# EAGLE schematic final header (EAGLE 9.6.1)
PAVA PRO TOP ADD & BLOCK
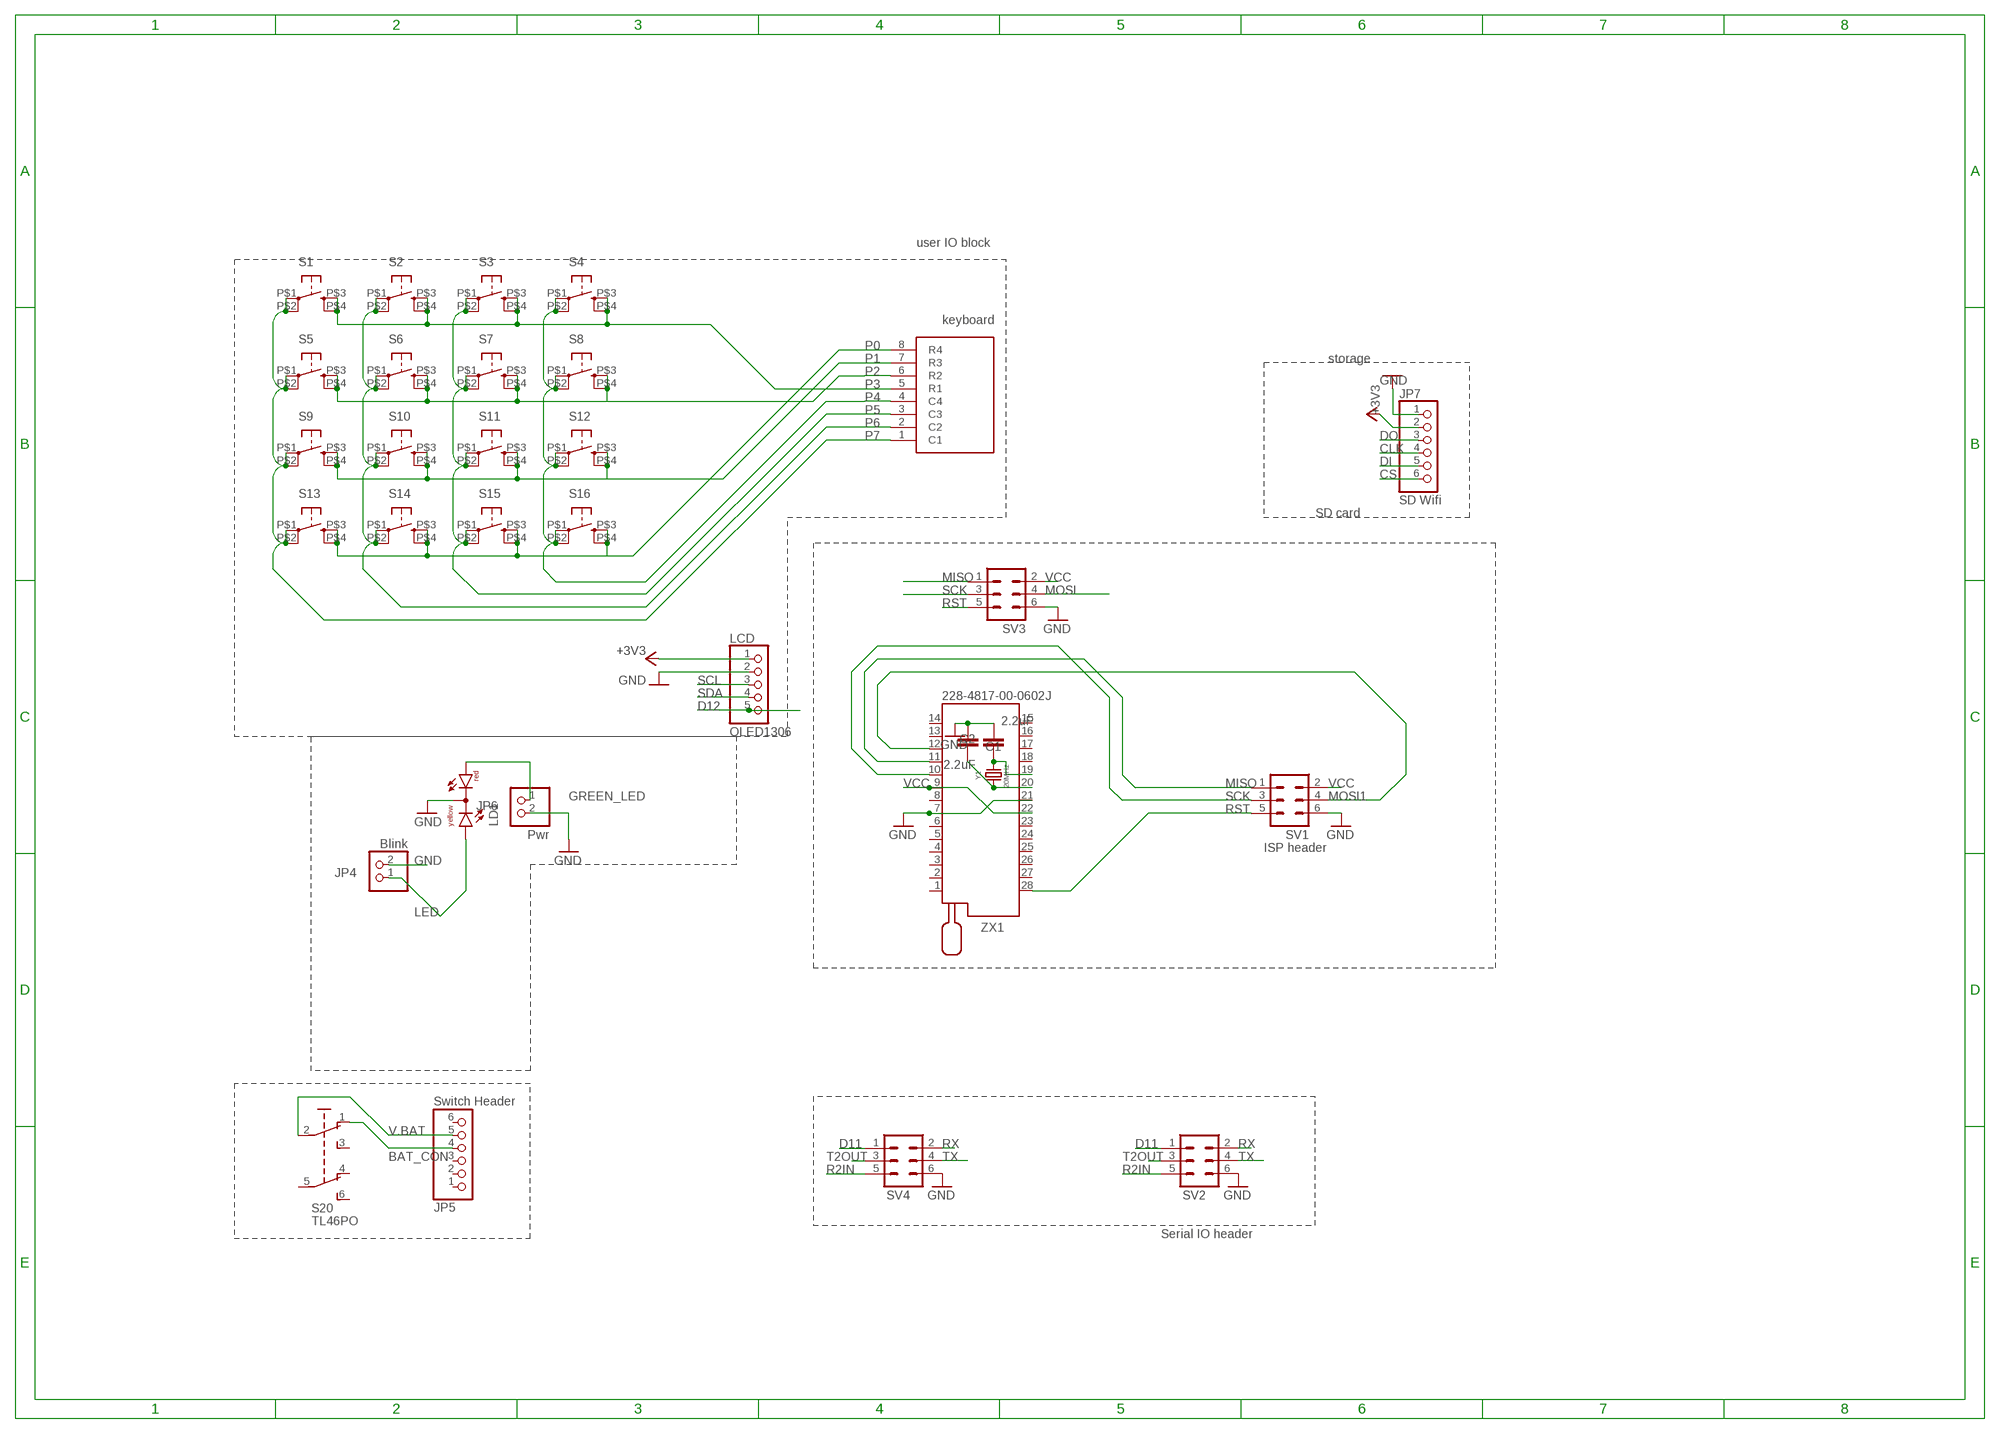
[diagram p0: schematic, sheet 1]

## Parts
C1  2.2uF  2.2UF-1206-50V-10%  [1206]
C2  2.2uF  2.2UF-1206-50V-10%  [1206]
JP4  Blink  PINHD-1X2  [1X02]
JP5  Switch Header  PINHD-1X6  [1X06]
JP6  Pwr  PINHD-1X2  [1X02]
JP7  SD Wifi  PINHD-1X6  [1X06]
LCD  OLED1306  PINHD-1X5  [1X05]
LD1  DUOLED-RY-C  [DUOLED-C-5MM]
S1  10-XX-SMD  [B3F-10XX-SMD]
S2  10-XX-SMD  [B3F-10XX-SMD]
S3  10-XX-SMD  [B3F-10XX-SMD]
S4  10-XX-SMD  [B3F-10XX-SMD]
S5  10-XX-SMD  [B3F-10XX-SMD]
S6  10-XX-SMD  [B3F-10XX-SMD]
S7  10-XX-SMD  [B3F-10XX-SMD]
S8  10-XX-SMD  [B3F-10XX-SMD]
S9  10-XX-SMD  [B3F-10XX-SMD]
S10  10-XX-SMD  [B3F-10XX-SMD]
S11  10-XX-SMD  [B3F-10XX-SMD]
S12  10-XX-SMD  [B3F-10XX-SMD]
S13  10-XX-SMD  [B3F-10XX-SMD]
S14  10-XX-SMD  [B3F-10XX-SMD]
S15  10-XX-SMD  [B3F-10XX-SMD]
S16  10-XX-SMD  [B3F-10XX-SMD]
S20  TL46PO  [TL4XPO]
SV1  ML6  [ML6]
SV2  ML6  [ML6]
SV3  ML6  [ML6]
SV4  ML6  [ML6]
U$7  KB1604  [KB1604]
Y1  20MHz  WE-XTAL_HC49/4HSMX_830061856  [WE-XTAL_HC49/4HSMX]
ZX1  228-4817-00-0602J  [228-4817-00-0602J]

## Nets
+3V3: JP7.2 LCD.1
BAT_CON: JP5.4 S20.1(O)
CLK: JP7.4
CS: JP7.6
D11: SV2.1 SV4.1
D12: LCD.5
DI: JP7.5
DO: JP7.3
GND: C1.2 C2.1 JP4.2 JP6.2 JP7.1 LCD.2 LD1.C SV1.6 SV2.6 SV3.6 SV4.6 ZX1.7 ZX1.21
GREEN_LED: JP6.1 LD1.AR
LED: JP4.1 LD1.AX(AY)
MISO: SV1.1 SV3.1 ZX1.11
MOSI: SV3.4
MOSI1: SV1.4 ZX1.12
N$2: C2.2 Y1.1 ZX1.20
N$3: C1.1 Y1.2 ZX1.19
N$35: S9.P$3(S) S9.P$4(S1) S10.P$3(S) S10.P$4(S1) S11.P$3(S) S11.P$4(S1) S12.P$3(S) S12.P$4(S1)
P0: S13.P$3(S) S13.P$4(S1) S14.P$3(S) S14.P$4(S1) S15.P$3(S) S15.P$4(S1) S16.P$3(S) S16.P$4(S1) U$7.8(R4)
P1: U$7.7(R3)
P2: S5.P$3(S) S5.P$4(S1) S6.P$3(S) S6.P$4(S1) S7.P$3(S) S7.P$4(S1) S8.P$3(S) S8.P$4(S1) U$7.6(R2)
P3: S1.P$3(S) S1.P$4(S1) S2.P$3(S) S2.P$4(S1) S3.P$3(S) S3.P$4(S1) S4.P$3(S) S4.P$4(S1) U$7.5(R1)
P4: S4.P$1(P) S4.P$2(P1) S8.P$1(P) S8.P$2(P1) S12.P$1(P) S12.P$2(P1) S16.P$1(P) S16.P$2(P1) U$7.4(C4)
P5: S3.P$1(P) S3.P$2(P1) S7.P$1(P) S7.P$2(P1) S11.P$1(P) S11.P$2(P1) S15.P$1(P) S15.P$2(P1) U$7.3(C3)
P6: S2.P$1(P) S2.P$2(P1) S6.P$1(P) S6.P$2(P1) S10.P$1(P) S10.P$2(P1) S14.P$1(P) S14.P$2(P1) U$7.2(C2)
P7: S1.P$1(P) S1.P$2(P1) S5.P$1(P) S5.P$2(P1) S9.P$1(P) S9.P$2(P1) S13.P$1(P) S13.P$2(P1) U$7.1(C1)
R2IN: SV2.5 SV4.5
RST: SV1.5 SV3.5 ZX1.28
RX: SV2.2 SV4.2
SCK: SV1.3 SV3.3 ZX1.10
SCL: LCD.3
SDA: LCD.4
T2OUT: SV2.3 SV4.3
TX: SV2.4 SV4.4
V.BAT: JP5.5 S20.2(P)
VCC: SV1.2 SV3.2 ZX1.9 ZX1.22
Unconnected: JP5.1 JP5.2 JP5.3 JP5.6 S20.3(S) S20.4(O1) S20.5(P1) S20.6(S1) ZX1.1 ZX1.2 ZX1.3 ZX1.4 ZX1.5 ZX1.6 ZX1.8 ZX1.13 ZX1.14 ZX1.15 ZX1.16 ZX1.17 ZX1.18 ZX1.23 ZX1.24 ZX1.25 ZX1.26 ZX1.27

## Notes on the sheet
- user IO block
- keyboard
- storage
- SD card
- ISP header
- Serial IO header

## Library data of the parts
C1 C2 = SparkFun-Capacitors:2.2UF: 2.2µF ceramic capacitors A capacitor is a passive two-terminal electrical component used to store electrical energy temporarily in an electric field.; PROD_ID: CAP-10009
JP4 JP6 = pinhead:PINHD-1X2: PIN HEADER
JP5 JP7 = pinhead:PINHD-1X6: PIN HEADER
LCD = pinhead:PINHD-1X5: PIN HEADER
LD1 = led:DUOLED-RY-C: DUO LED 2 colors (red/yellow), 5 mm, round, common Cathode www.ligitek.com or other producers.
S1-S16 = switch-omron:10-XX-SMD
S20 = switch:TL46PO: TINY SWITCH ON - ON Source: http://www2.produktinfo.conrad.com/datenblaetter/700000-724999/705152-da-01-de-Subminiaturschalter_TL_36YO.pdf
SV1-SV4 = con-harting-ml:ML6: HARTING
U$7 = _moja:KB1604
Y1 = Wurth_Quartz Crystals & Oscillators_WE-XTAL:WE-XTAL_HC49/4HSMX: WE-XTAL Quartz Crystal Characteristics SMT and THT models Hermetically sealed Frequencies between 1.8432 MHz and 50 MHz Tolerances down to ±10 ppm available Maximum operating temperatures range: -40 °C to 85 °C Stabilities down to ±10 ppm available Applications Microprocessor Wireless Communication Devices Industrial Devices Wired Communication (e.g. Ethernet and USB) IoT Optical Network Audio and Multimedia Devices Test and Measurement Equipment Navigation and Locators Wearables <https://www.we-online.com/catalog/media/o135919v209%20Family_WE-XTAL_IQXC-42.jpg> Details see: https://www.we-online.com/catalog/en/WE-XTAL Updated by Ella Wu , 2019-09-03 2019 (C) Wurth Elektronik; C-LOAD: 18pF; DATASHEET-URL: https://www.we-online.com/catalog/datasheet/830061856.pdf; MOUNT: SMT; PART-NUMBER: 830061856; STABILITY: 10ppm; TOLERANCE: ±10ppm
ZX1 = con-3m:228-?00-0602J: Zero Insertion Force Socked Source: http://www.3M.com/ehpd; MF: 3M; MPN: 228-4817-00-0602J; OC_FARNELL: 1252775; OC_NEWARK: 85K7834

## Net classes
1 power: width 0.305 mm